# EAGLE schematic relays (EAGLE 9.6.2)
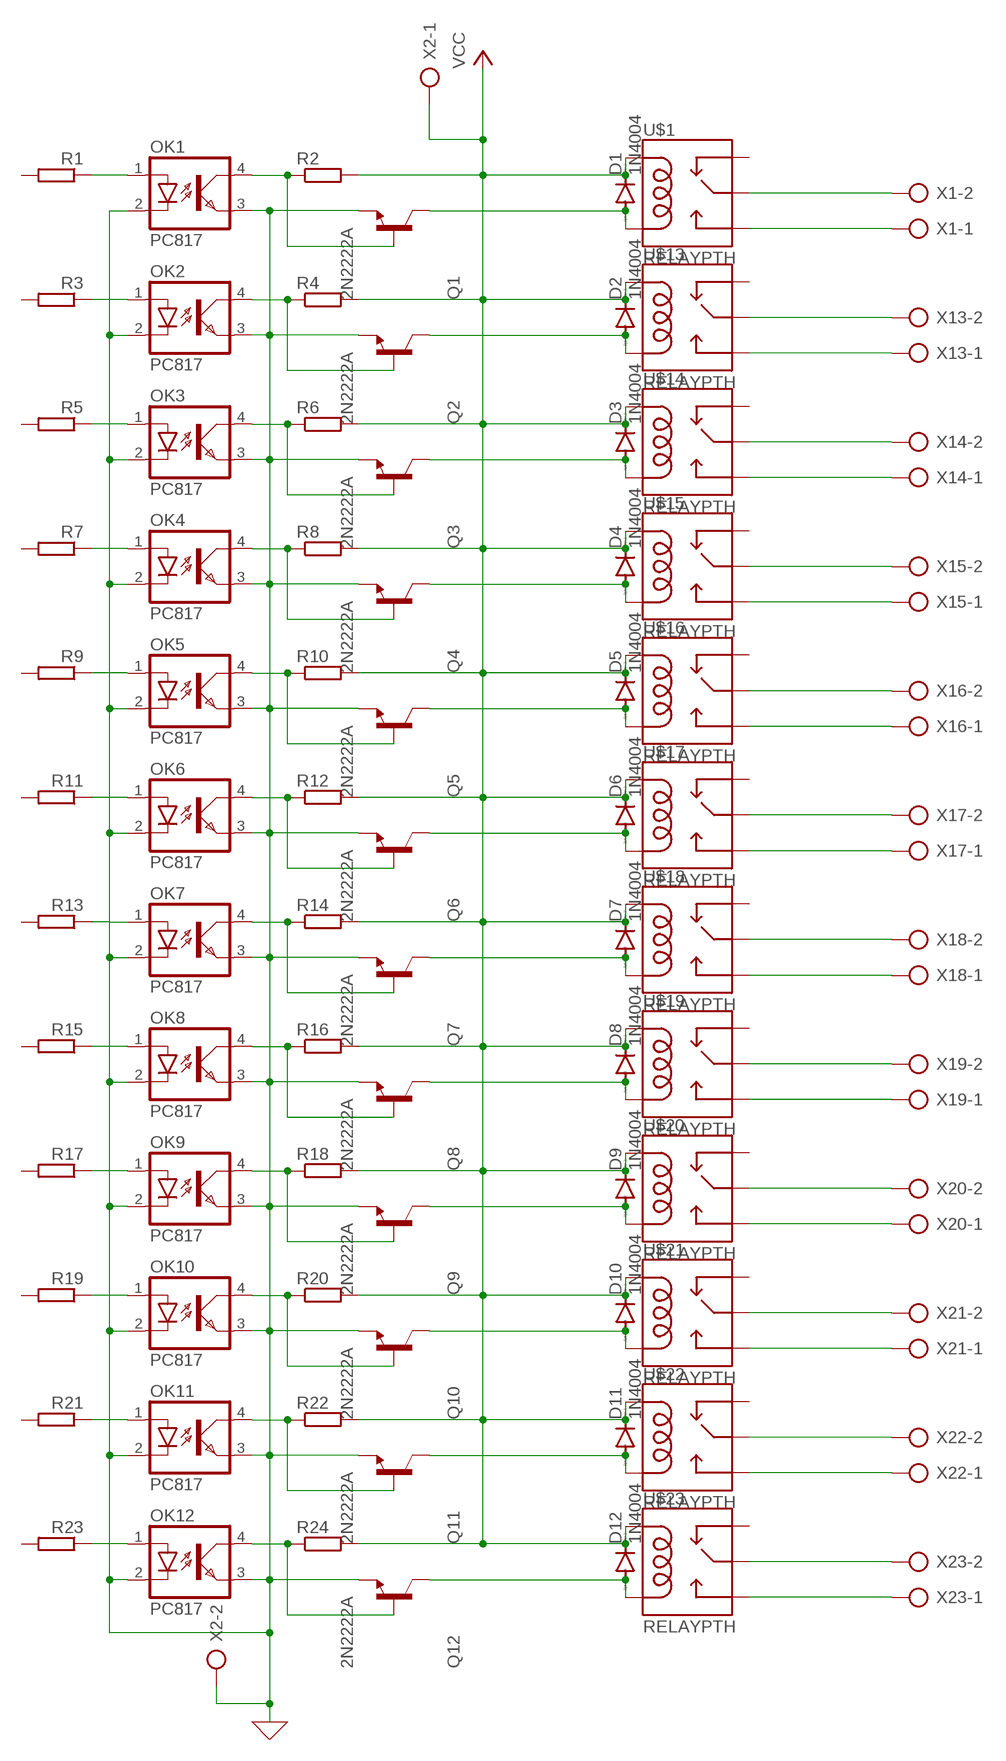
[diagram p0: schematic, sheet 1]

## Parts
D1  1N4004  [DO41-10]
D2  1N4004  [DO41-10]
D3  1N4004  [DO41-10]
D4  1N4004  [DO41-10]
D5  1N4004  [DO41-10]
D6  1N4004  [DO41-10]
D7  1N4004  [DO41-10]
D8  1N4004  [DO41-10]
D9  1N4004  [DO41-10]
D10  1N4004  [DO41-10]
D11  1N4004  [DO41-10]
D12  1N4004  [DO41-10]
OK1  PC817  [DIL04]
OK2  PC817  [DIL04]
OK3  PC817  [DIL04]
OK4  PC817  [DIL04]
OK5  PC817  [DIL04]
OK6  PC817  [DIL04]
OK7  PC817  [DIL04]
OK8  PC817  [DIL04]
OK9  PC817  [DIL04]
OK10  PC817  [DIL04]
OK11  PC817  [DIL04]
OK12  PC817  [DIL04]
Q1  2N2222A  [TO92254P470H750-3]
Q2  2N2222A  [TO92254P470H750-3]
Q3  2N2222A  [TO92254P470H750-3]
Q4  2N2222A  [TO92254P470H750-3]
Q5  2N2222A  [TO92254P470H750-3]
Q6  2N2222A  [TO92254P470H750-3]
Q7  2N2222A  [TO92254P470H750-3]
Q8  2N2222A  [TO92254P470H750-3]
Q9  2N2222A  [TO92254P470H750-3]
Q10  2N2222A  [TO92254P470H750-3]
Q11  2N2222A  [TO92254P470H750-3]
Q12  2N2222A  [TO92254P470H750-3]
R1  R-EU_0309/12  [0309/12]
R2  R-EU_0309/12  [0309/12]
R3  R-EU_0309/12  [0309/12]
R4  R-EU_0309/12  [0309/12]
R5  R-EU_0309/12  [0309/12]
R6  R-EU_0309/12  [0309/12]
R7  R-EU_0309/12  [0309/12]
R8  R-EU_0309/12  [0309/12]
R9  R-EU_0309/12  [0309/12]
R10  R-EU_0309/12  [0309/12]
R11  R-EU_0309/12  [0309/12]
R12  R-EU_0309/12  [0309/12]
R13  R-EU_0309/12  [0309/12]
R14  R-EU_0309/12  [0309/12]
R15  R-EU_0309/12  [0309/12]
R16  R-EU_0309/12  [0309/12]
R17  R-EU_0309/12  [0309/12]
R18  R-EU_0309/12  [0309/12]
R19  R-EU_0309/12  [0309/12]
R20  R-EU_0309/12  [0309/12]
R21  R-EU_0309/12  [0309/12]
R22  R-EU_0309/12  [0309/12]
R23  R-EU_0309/12  [0309/12]
R24  R-EU_0309/12  [0309/12]
U$1  RELAYPTH  [SRD-05VDC-SL-C]
U$13  RELAYPTH  [SRD-05VDC-SL-C]
U$14  RELAYPTH  [SRD-05VDC-SL-C]
U$15  RELAYPTH  [SRD-05VDC-SL-C]
U$16  RELAYPTH  [SRD-05VDC-SL-C]
U$17  RELAYPTH  [SRD-05VDC-SL-C]
U$18  RELAYPTH  [SRD-05VDC-SL-C]
U$19  RELAYPTH  [SRD-05VDC-SL-C]
U$20  RELAYPTH  [SRD-05VDC-SL-C]
U$21  RELAYPTH  [SRD-05VDC-SL-C]
U$22  RELAYPTH  [SRD-05VDC-SL-C]
U$23  RELAYPTH  [SRD-05VDC-SL-C]
X1  AK500/2-H  [AK500/2-H]
X2  AK500/2-H  [AK500/2-H]
X13  AK500/2-H  [AK500/2-H]
X14  AK500/2-H  [AK500/2-H]
X15  AK500/2-H  [AK500/2-H]
X16  AK500/2-H  [AK500/2-H]
X17  AK500/2-H  [AK500/2-H]
X18  AK500/2-H  [AK500/2-H]
X19  AK500/2-H  [AK500/2-H]
X20  AK500/2-H  [AK500/2-H]
X21  AK500/2-H  [AK500/2-H]
X22  AK500/2-H  [AK500/2-H]
X23  AK500/2-H  [AK500/2-H]

## Nets
0: OK1.2(C) OK1.3(EMIT) OK2.2(C) OK2.3(EMIT) OK3.2(C) OK3.3(EMIT) OK4.2(C) OK4.3(EMIT) OK5.2(C) OK5.3(EMIT) OK6.2(C) OK6.3(EMIT) OK7.2(C) OK7.3(EMIT) OK8.2(C) OK8.3(EMIT) OK9.2(C) OK9.3(EMIT) OK10.2(C) OK10.3(EMIT) OK11.2(C) OK11.3(EMIT) OK12.2(C) OK12.3(EMIT) Q1.1(E) Q2.1(E) Q3.1(E) Q4.1(E) Q5.1(E) Q6.1(E) Q7.1(E) Q8.1(E) Q9.1(E) Q10.1(E) Q11.1(E) Q12.1(E) X2.2 ; supply symbol labelled GND
N$1: U$1.SWCOMMON X1.2
N$2: U$1.SWOPEN X1.1
N$25: OK1.1(A) R1.1
N$26: OK1.4(COL) Q1.2(B) R2.1
N$27: U$13.SWCOMMON X13.2
N$28: D1.A Q1.3(C) U$1.COIL0
N$31: U$13.SWOPEN X13.1
N$32: OK2.1(A) R3.1
N$33: OK2.4(COL) Q2.2(B) R4.1
N$34: D2.A Q2.3(C) U$13.COIL0
N$37: U$14.SWCOMMON X14.2
N$38: U$14.SWOPEN X14.1
N$39: OK3.1(A) R5.1
N$40: OK3.4(COL) Q3.2(B) R6.1
N$41: D3.A Q3.3(C) U$14.COIL0
N$44: U$15.SWCOMMON X15.2
N$45: U$15.SWOPEN X15.1
N$46: OK4.1(A) R7.1
N$47: OK4.4(COL) Q4.2(B) R8.1
N$48: D4.A Q4.3(C) U$15.COIL0
N$51: U$16.SWCOMMON X16.2
N$52: U$16.SWOPEN X16.1
N$53: OK5.1(A) R9.1
N$54: OK5.4(COL) Q5.2(B) R10.1
N$55: D5.A Q5.3(C) U$16.COIL0
N$58: U$17.SWCOMMON X17.2
N$59: U$17.SWOPEN X17.1
N$60: OK6.1(A) R11.1
N$61: OK6.4(COL) Q6.2(B) R12.1
N$62: D6.A Q6.3(C) U$17.COIL0
N$65: U$18.SWCOMMON X18.2
N$66: U$18.SWOPEN X18.1
N$67: OK7.1(A) R13.1
N$68: OK7.4(COL) Q7.2(B) R14.1
N$69: D7.A Q7.3(C) U$18.COIL0
N$72: U$19.SWCOMMON X19.2
N$73: U$19.SWOPEN X19.1
N$74: OK8.1(A) R15.1
N$75: OK8.4(COL) Q8.2(B) R16.1
N$76: D8.A Q8.3(C) U$19.COIL0
N$79: U$20.SWCOMMON X20.2
N$80: U$20.SWOPEN X20.1
N$81: OK9.1(A) R17.1
N$82: OK9.4(COL) Q9.2(B) R18.1
N$83: D9.A Q9.3(C) U$20.COIL0
N$86: U$21.SWCOMMON X21.2
N$87: U$21.SWOPEN X21.1
N$88: OK10.1(A) R19.1
N$89: OK10.4(COL) Q10.2(B) R20.1
N$90: D10.A Q10.3(C) U$21.COIL0
N$93: U$22.SWCOMMON X22.2
N$94: U$22.SWOPEN X22.1
N$95: OK11.1(A) R21.1
N$96: OK11.4(COL) Q11.2(B) R22.1
N$97: D11.A Q11.3(C) U$22.COIL0
N$100: U$23.SWCOMMON X23.2
N$101: U$23.SWOPEN X23.1
N$102: OK12.1(A) R23.1
N$103: OK12.4(COL) Q12.2(B) R24.1
N$104: D12.A Q12.3(C) U$23.COIL0
VCC: D1.C D2.C D3.C D4.C D5.C D6.C D7.C D8.C D9.C D10.C D11.C D12.C R2.2 R4.2 R6.2 R8.2 R10.2 R12.2 R14.2 R16.2 R18.2 R20.2 R22.2 R24.2 U$1.COIL1 U$13.COIL1 U$14.COIL1 U$15.COIL1 U$16.COIL1 U$17.COIL1 U$18.COIL1 U$19.COIL1 U$20.COIL1 U$21.COIL1 U$22.COIL1 U$23.COIL1 X2.1
Unconnected: R1.2 R3.2 R5.2 R7.2 R9.2 R11.2 R13.2 R15.2 R17.2 R19.2 R21.2 R23.2 U$1.SWCLOSED(SWCLOSE) U$13.SWCLOSED(SWCLOSE) U$14.SWCLOSED(SWCLOSE) U$15.SWCLOSED(SWCLOSE) U$16.SWCLOSED(SWCLOSE) U$17.SWCLOSED(SWCLOSE) U$18.SWCLOSED(SWCLOSE) U$19.SWCLOSED(SWCLOSE) U$20.SWCLOSED(SWCLOSE) U$21.SWCLOSED(SWCLOSE) U$22.SWCLOSED(SWCLOSE) U$23.SWCLOSED(SWCLOSE)

## Library data of the parts
D1-D12 = diode:1N4004: DIODE general purpose rectifier, 1 A
OK1-OK12 = optocoupler:PC817: SHARP OPTO COUPLER; MPN: PC817X4J000F; OC_FARNELL: 9707727; OC_NEWARK: 97K7059
Q1-Q12 = 2N2222A:2N2222A: Check availability <https://pricing.snapeda.com/parts/2N2222A/Diotec%20Semiconductor/view-part?ref=eda>; AVAILABILITY: In Stock; CHECK_PRICES: https://www.snapeda.com/parts/2N2222A/Diotec/view-part/?ref=eda; DESCRIPTION: BJT, TO-92, 40V, 600mA, NPN, 0.625W, 150°C; MF: Diotec Semiconductor; MP: 2N2222A; PACKAGE: TO-92 Diotec; PRICE: None; PURCHASE-URL: https://www.snapeda.com/api/url_track_click_mouser/?unipart_id=4796189&manufacturer=Diotec Semiconductor&part_name=2N2222A&search_term=None; SNAPEDA_LINK: https://www.snapeda.com/parts/2N2222A/Diotec/view-part/?ref=snap
R1-R24 = rcl:R-EU_: RESISTOR, European symbol; SPICEPREFIX: R
U$1 U$13-U$23 = SRD-05VDC-SL-C:RELAY: SPDT relay (COM-00101)
X1 X2 X13-X23 = con-ptr500:AK500/2-H: CONNECTOR Aug. 2004 / PTR Meßtechnik: Die Bezeichnung der Serie AK505 wurde geändert. Es handelt sich hierbei um AK500 in horizontaler Ausführung.; OC_FARNELL: unknown; OC_NEWARK: unknown